# Altium schematic sheet Button.SchDoc
size D
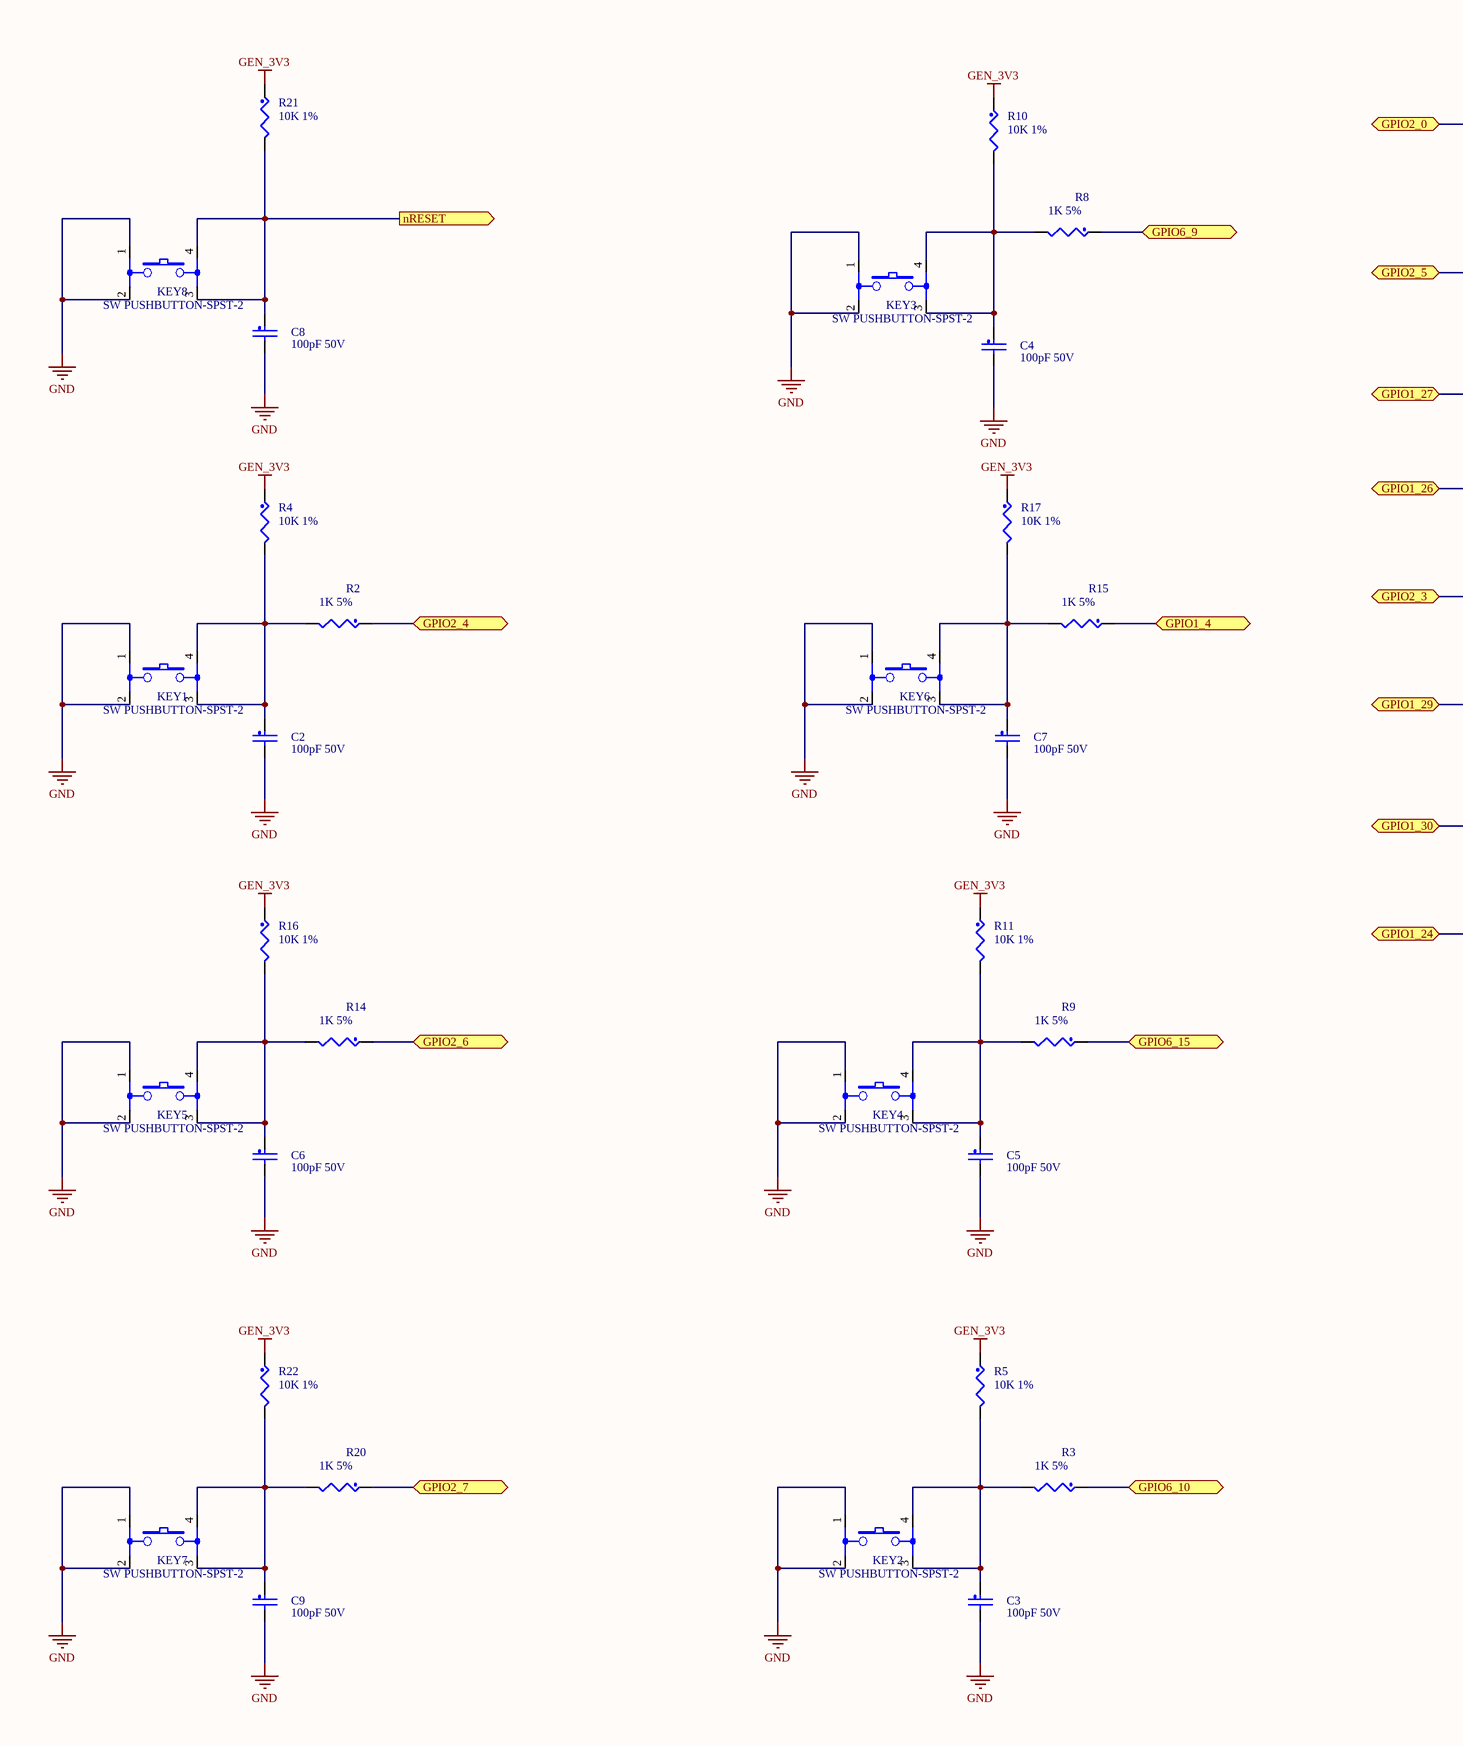
[diagram p0: Button.SchDoc, left]
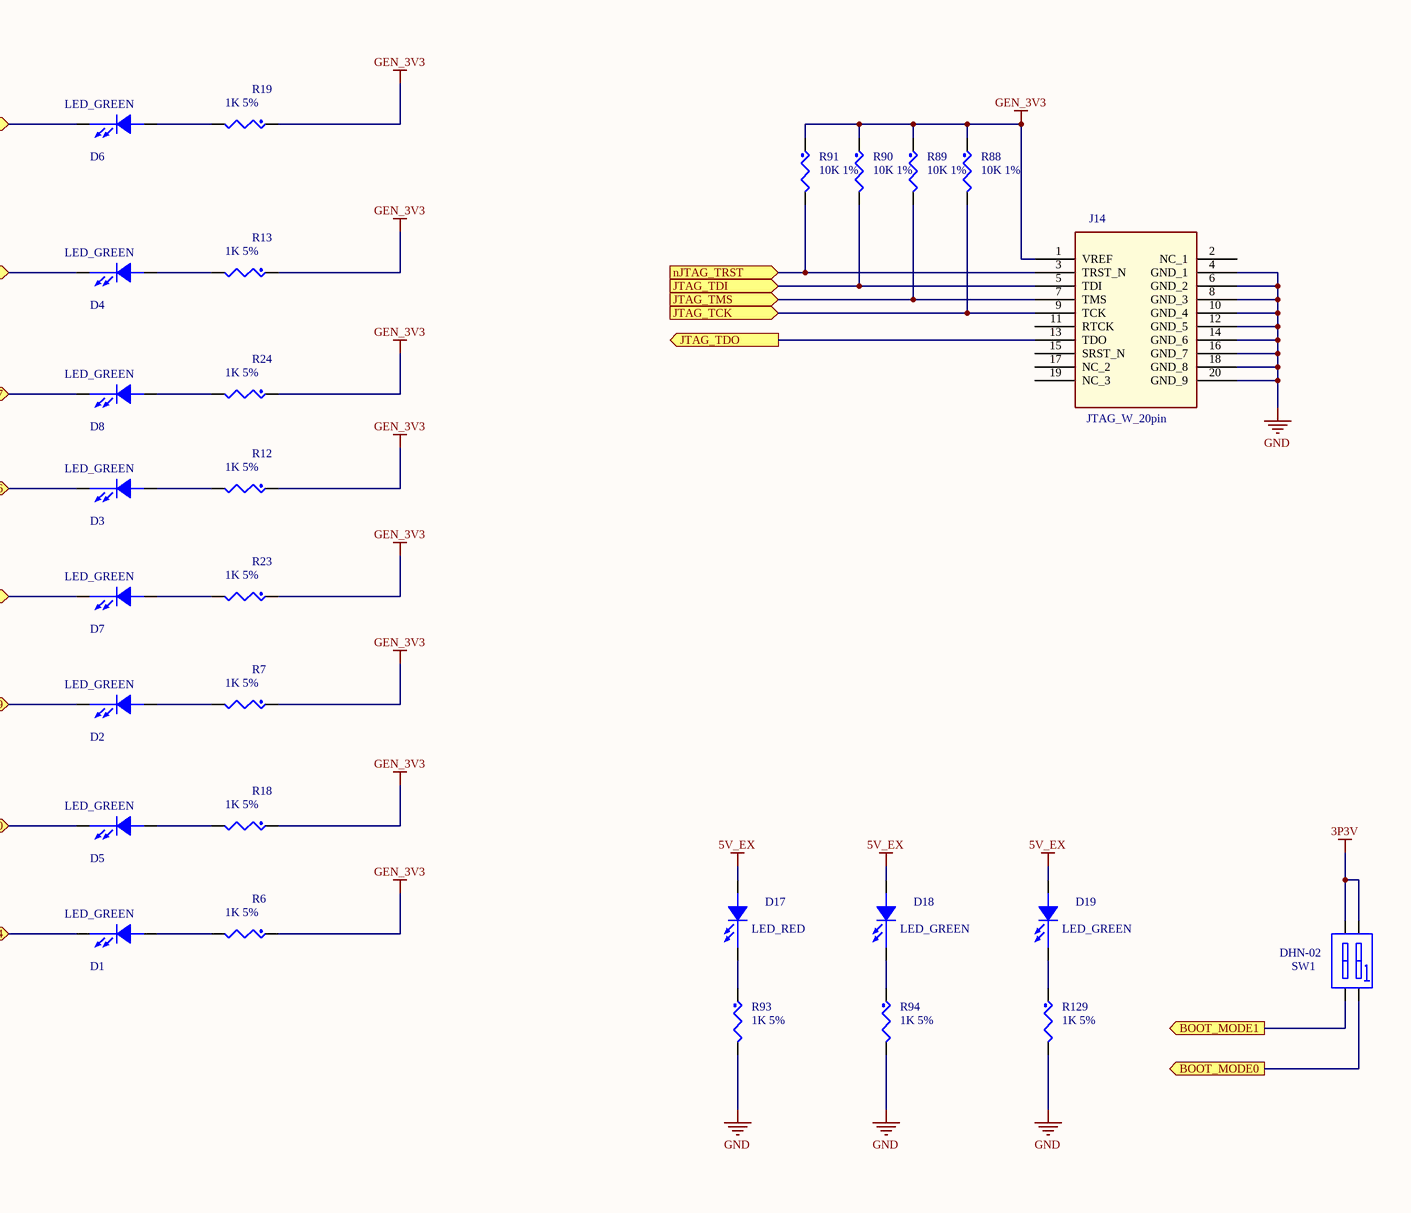
[diagram p1: Button.SchDoc, right]

## Parts
C2  100pF 50V  [SC0603]
C3  100pF 50V  [SC0603]
C4  100pF 50V  [SC0603]
C5  100pF 50V  [SC0603]
C6  100pF 50V  [SC0603]
C7  100pF 50V  [SC0603]
C8  100pF 50V  [SC0603]
C9  100pF 50V  [SC0603]
D1  LED_GREEN  [SD0603]
D2  LED_GREEN  [SD0603]
D3  LED_GREEN  [SD0603]
D4  LED_GREEN  [SD0603]
D5  LED_GREEN  [SD0603]
D6  LED_GREEN  [SD0603]
D7  LED_GREEN  [SD0603]
D8  LED_GREEN  [SD0603]
D17  LED_RED  [SD0603]
D18  LED_GREEN  [SD0603]
D19  LED_GREEN  [SD0603]
J14  JTAG_W_20pin  [DIPMH-2-2P54X2P54-20-8-W]
KEY1  SW PUSHBUTTON-SPST-2  [SB4-6X6-5-1]
KEY2  SW PUSHBUTTON-SPST-2  [SB4-6X6-5-1]
KEY3  SW PUSHBUTTON-SPST-2  [SB4-6X6-5-1]
KEY4  SW PUSHBUTTON-SPST-2  [SB4-6X6-5-1]
KEY5  SW PUSHBUTTON-SPST-2  [SB4-6X6-5-1]
KEY6  SW PUSHBUTTON-SPST-2  [SB4-6X6-5-1]
KEY7  SW PUSHBUTTON-SPST-2  [SB4-6X6-5-1]
KEY8  SW PUSHBUTTON-SPST-2  [SB4-6X6-5-1]
R2  1K 5%  [SR0603]
R3  1K 5%  [SR0603]
R4  10K 1%  [SR0603]
R5  10K 1%  [SR0603]
R6  1K 5%  [SR0603]
R7  1K 5%  [SR0603]
R8  1K 5%  [SR0603]
R9  1K 5%  [SR0603]
R10  10K 1%  [SR0603]
R11  10K 1%  [SR0603]
R12  1K 5%  [SR0603]
R13  1K 5%  [SR0603]
R14  1K 5%  [SR0603]
R15  1K 5%  [SR0603]
R16  10K 1%  [SR0603]
R17  10K 1%  [SR0603]
R18  1K 5%  [SR0603]
R19  1K 5%  [SR0603]
R20  1K 5%  [SR0603]
R21  10K 1%  [SR0603]
R22  10K 1%  [SR0603]
R23  1K 5%  [SR0603]
R24  1K 5%  [SR0603]
R88  10K 1%  [SR0603]
R89  10K 1%  [SR0603]
R90  10K 1%  [SR0603]
R91  10K 1%  [SR0603]
R93  1K 5%  [SR0603]
R94  1K 5%  [SR0603]
R129  1K 5%  [SR0603]
SW1  DHN-02  [SW4-10X4-2-1]

## Ports
BOOT_MODE0 (out), BOOT_MODE1 (out), GPIO1_4 (bidir), GPIO1_24 (bidir), GPIO1_26 (bidir), GPIO1_27 (bidir), GPIO1_29 (bidir), GPIO1_30 (bidir), GPIO2_0 (bidir), GPIO2_3 (bidir), GPIO2_4 (bidir), GPIO2_5 (bidir), GPIO2_6 (bidir), GPIO2_7 (bidir), GPIO6_9 (bidir), GPIO6_10 (bidir), GPIO6_15 (bidir), JTAG_TCK (in), JTAG_TDI (in), JTAG_TDO (out), JTAG_TMS (in), nJTAG_TRST (in), nRESET (out)

## Nets
3P3V: SW1.1(A1) SW1.2(A2)
5V_EX: D17.1(ANODE) D18.1(ANODE) D19.1(ANODE)
GEN_3V3: J14.1(VREF) R4.1 R5.1 R6.1 R7.1 R10.1 R11.1 R12.1 R13.1 R16.1 R17.1 R18.1 R19.1 R21.1 R22.1 R23.1 R24.1 R88.1 R89.1 R90.1 R91.1
GND: C2.2 C3.2 C4.2 C5.2 C6.2 C7.2 C8.2 C9.2 J14.4(GND_1) J14.6(GND_2) J14.8(GND_3) J14.10(GND_4) J14.12(GND_5) J14.14(GND_6) J14.16(GND_7) J14.18(GND_8) J14.20(GND_9) KEY1.1 KEY1.2 KEY2.1 KEY2.2 KEY3.1 KEY3.2 KEY4.1 KEY4.2 KEY5.1 KEY5.2 KEY6.1 KEY6.2 KEY7.1 KEY7.2 KEY8.1 KEY8.2 R93.2 R94.2 R129.2
BOOT_MODE0: SW1.4(B1) ; port BOOT_MODE0
BOOT_MODE1: SW1.3(B2) ; port BOOT_MODE1
GPIO1_4: R15.1 ; port GPIO1_4
GPIO1_24: D1.2(CATHODE) ; port GPIO1_24
GPIO1_26: D3.2(CATHODE) ; port GPIO1_26
GPIO1_27: D8.2(CATHODE) ; port GPIO1_27
GPIO1_29: D2.2(CATHODE) ; port GPIO1_29
GPIO1_30: D5.2(CATHODE) ; port GPIO1_30
GPIO2_0: D6.2(CATHODE) ; port GPIO2_0
GPIO2_3: D7.2(CATHODE) ; port GPIO2_3
GPIO2_4: R2.1 ; port GPIO2_4
GPIO2_5: D4.2(CATHODE) ; port GPIO2_5
GPIO2_6: R14.1 ; port GPIO2_6
GPIO2_7: R20.1 ; port GPIO2_7
GPIO6_9: R8.1 ; port GPIO6_9
GPIO6_10: R3.1 ; port GPIO6_10
GPIO6_15: R9.1 ; port GPIO6_15
JTAG_TCK: J14.9(TCK) R88.2 ; port JTAG_TCK
JTAG_TDI: J14.5(TDI) R90.2 ; port JTAG_TDI
JTAG_TDO: J14.13(TDO) ; port JTAG_TDO
JTAG_TMS: J14.7(TMS) R89.2 ; port JTAG_TMS
nJTAG_TRST: J14.3(TRST_N) R91.2 ; port nJTAG_TRST
nRESET: C8.1 KEY8.3 KEY8.4 R21.2 ; port nRESET
NetC2_1: C2.1 KEY1.3 KEY1.4 R2.2 R4.2
NetC3_1: C3.1 KEY2.3 KEY2.4 R3.2 R5.2
NetC4_1: C4.1 KEY3.3 KEY3.4 R8.2 R10.2
NetC5_1: C5.1 KEY4.3 KEY4.4 R9.2 R11.2
NetC6_1: C6.1 KEY5.3 KEY5.4 R14.2 R16.2
NetC7_1: C7.1 KEY6.3 KEY6.4 R15.2 R17.2
NetC9_1: C9.1 KEY7.3 KEY7.4 R20.2 R22.2
NetD1_1: D1.1(ANODE) R6.2
NetD2_1: D2.1(ANODE) R7.2
NetD3_1: D3.1(ANODE) R12.2
NetD4_1: D4.1(ANODE) R13.2
NetD5_1: D5.1(ANODE) R18.2
NetD6_1: D6.1(ANODE) R19.2
NetD7_1: D7.1(ANODE) R23.2
NetD8_1: D8.1(ANODE) R24.2
NetD17_2: D17.2(CATHODE) R93.1
NetD18_2: D18.2(CATHODE) R94.1
NetD19_2: D19.2(CATHODE) R129.1

Not connected (* = marked no-connect by the designer): J14 2(NC_1) 11(RTCK) 15(SRST_N) 17(NC_2) 19(NC_3)

## Library data of the parts
C2-C9 = CAP_NP: CLASS: DISCRETE
D1-D8 D17-D19 = LED
J14 = JTAG_20pin
R2-R24 R88-R91 R93 R94 R129 = RES: CLASS: DISCRETE
SW1 = SW DIP-2_0